# EAGLE design pc_kalam_sense_cap (EAGLE 6.4)
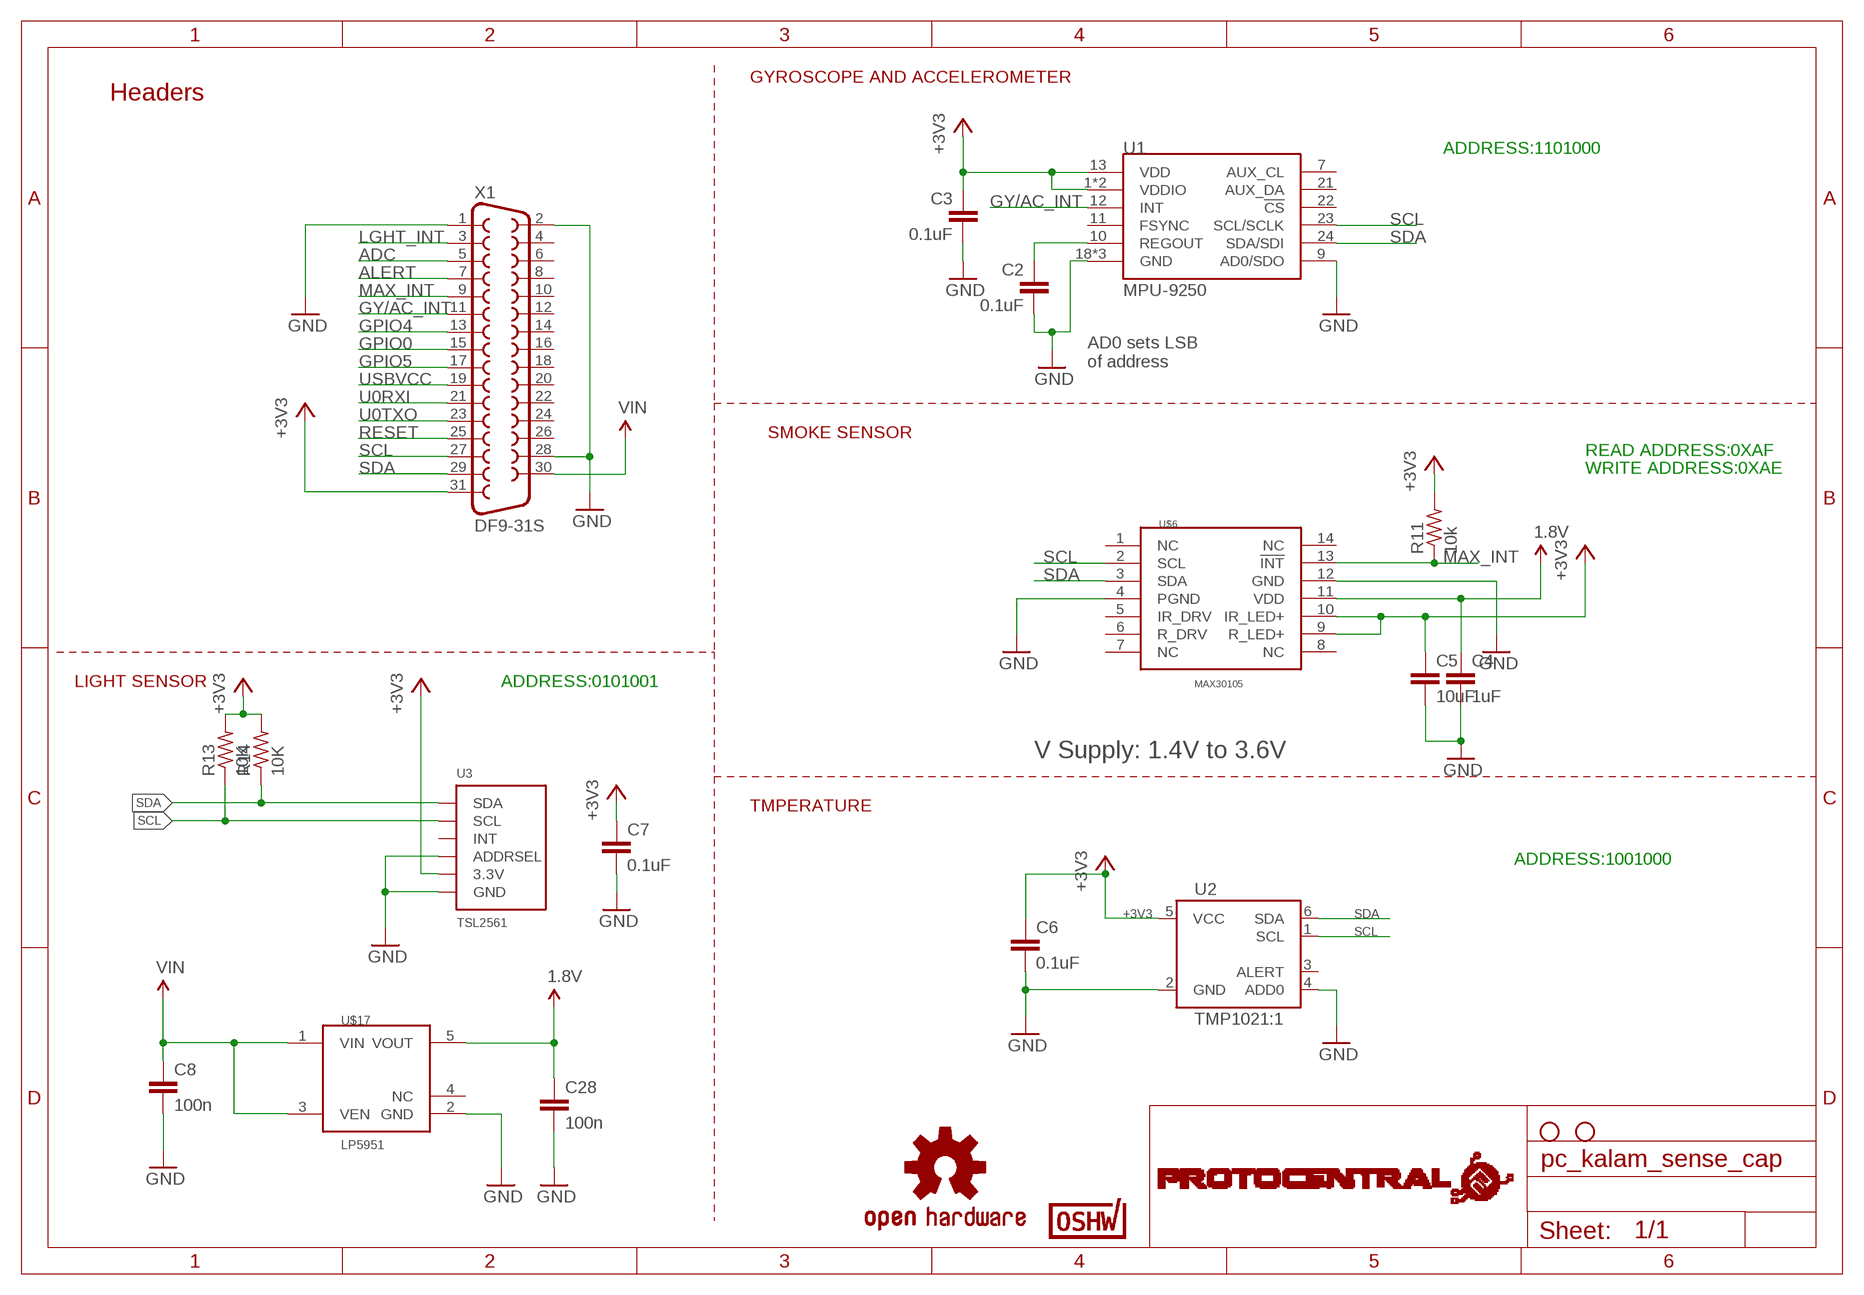
[diagram p0: schematic, sheet 1]

## Parts
C2  0.1uF  0.1UF-25V(+80/-20%)(0603)  [0603-CAP]
C3  0.1uF  0.1UF-25V(+80/-20%)(0603)  [0603-CAP]
C4  1uF  C-EUC0805  [C0805]
C5  10uF  C-EUC0805  [C0805]
C6  0.1uF  CAP0603-CAP  [0603-CAP]
C7  0.1uF  C-EUC0805  [C0805]
C8  100n  C-EUC0402  [C0402]
C28  100n  C-EUC0402  [C0402]
R11  10k  R-US_R0402  [R0402]
R13  10K  R-US_R0805  [R0805]
R14  10K  R-US_R0805  [R0805]
STANDOFF7  STAND-OFF  [STAND-OFF]
STANDOFF8  STAND-OFF  [STAND-OFF]
U1  MPU-9250  [QFN24_PAD]
U2  TMP1021:1  [SOT563-2]
U3  TSL2561  [TSL2561_FN]
U$2  CERT-SMALL  [CERT-SMALL-SILK]
U$3  OSHW-LOGOS  [OSHW-LOGO-S]
U$6  MAX30105  MAX30100  [OESIP-14]
U$9  PROTY_LOGO_WITH_TEXT  [PROTY_WITH_TEXT]
U$17  LP5951  [SC70-5]
X1  DF9-31S  [DF9-31S]

## Nets
1.8V: C4.1 C28.1 U$6.11(VDD) U$17.5(VOUT)
+3V3: C3.1 C5.1 C6.1 C7.1 R11.2 R13.2 R14.2 U1.1(VDDIO) U1.8(VDDIO) U1.13(VDD) U2.5(VCC) U3.VDD(3.3V) U$6.9(R_LED+) U$6.10(IR_LED+) X1.31
ADC: X1.5
ALERT: X1.7
GND: C2.2 C3.2 C4.2 C5.2 C6.2 C7.2 C8.2 C28.2 U1.9(AD0/SDO) U1.18(GND) U1.20(GND) U1.CENTER(GND) U2.2(GND) U2.4(ADD0) U3.ADR(ADDRSEL) U3.VSS(GND) U$6.4(PGND) U$6.12(GND) U$17.2(GND) X1.1 X1.2 X1.28
GPIO0: X1.15
GPIO4: X1.13
GPIO5: X1.17
GY/AC_INT: U1.12(INT) X1.11
LGHT_INT: X1.3
MAX_INT: R11.1 U$6.13(!INT) X1.9
REGOUT: C2.1 U1.10(REGOUT)
RESET: X1.25
SCL: R13.1 U1.23(SCL/SCLK) U2.1(SCL) U3.CLK(SCL) U$6.2(SCL) X1.27
SDA: R14.1 U1.24(SDA/SDI) U2.6(SDA) U3.DATA(SDA) U$6.3(SDA) X1.29
U0RXI: X1.21
U0TXO: X1.23
USBVCC: X1.19
VIN: C8.1 U$17.1(VIN) U$17.3(VEN) X1.30
Unconnected: U1.7(AUX_CL) U1.11(FSYNC) U1.21(AUX_DA) U1.22(!CS) U2.3(ALERT) U3.INT U$6.1(NC) U$6.5(IR_DRV) U$6.6(R_DRV) U$6.7(NC) U$6.8(NC) U$6.14(NC) U$17.4(NC) X1.4 X1.6 X1.8 X1.10 X1.12 X1.14 X1.16 X1.18 X1.20 X1.22 X1.24 X1.26

## Notes on the sheet
- GYROSCOPE AND ACCELEROMETER
- Headers
- ADDRESS:1101000
- AD0 sets LSB
  of address
- SMOKE SENSOR
- READ ADDRESS:0XAF
- WRITE ADDRESS:0XAE
- LIGHT SENSOR | ADDRESS:0101001
- V Supply: 1.4V to 3.6V
- TMPERATURE
- ADDRESS:1001000

## Library data of the parts
C2 C3 = SparkFun-Capacitors:0.1UF-25V(+80/-20%)(0603): CAP-00810 Ceramic Standard decoupling cap; PROD_ID: CAP-00810
C4 C5 C7 C8 C28 = rcl:C-EU: CAPACITOR, European symbol
C6 = SparkFun:CAP: Capacitor Standard 0603 ceramic capacitor, and 0.1" leaded capacitor.
R11 R13 R14 = rcl:R-US_: RESISTOR, American symbol
STANDOFF7 STANDOFF8 = SparkFun-Electromechanical:STAND-OFF: #4 Stand Off This is the mechanical footprint for a #4 phillips button head screw. Use the keepout ring to avoid running the screw head into surrounding components. SKU : PRT-00447
U1 = Testing:MPU-9250: NC pin 19. 2-6 & 14-17 not internally connected. May be used for PCB trace routing.; PROD_ID: IC-13192
U2 = SparkFun-Sensors:TMP102: I2C degC temp sensor
U3 = microbuilder:TSL2561: TSL2561 Light-To-Digital Sensor Mouser Part Numbers: CS (obsolete): 856-TSL2561CS DFN (cheapest): 856-TSL2561FN
U$2 = OSHWA:CERT
U$3 = SparkFun:OSHW-LOGO: Open Source Hardware Logo This logo indicates the piece of hardware it is found on incorporates a OSHW license and/or adheres to the definition of open source hardware found here: http://freedomdefined.org/OSHW
U$6 = circuitects:MAX30100
U$9 = circuitects:PROTY_LOGO_WITH_TEXT
U$17 = circuitects:LP5951
X1 = con-hirose:DF9-31S: SMD CONNECTOR Source: con-hirose.lbr from Bob Starr <rtzaudio@mindspring.com>; MPN: DF9-31S-1V(32); OC_FARNELL: 1798382; OC_NEWARK: 74R3383

## Board
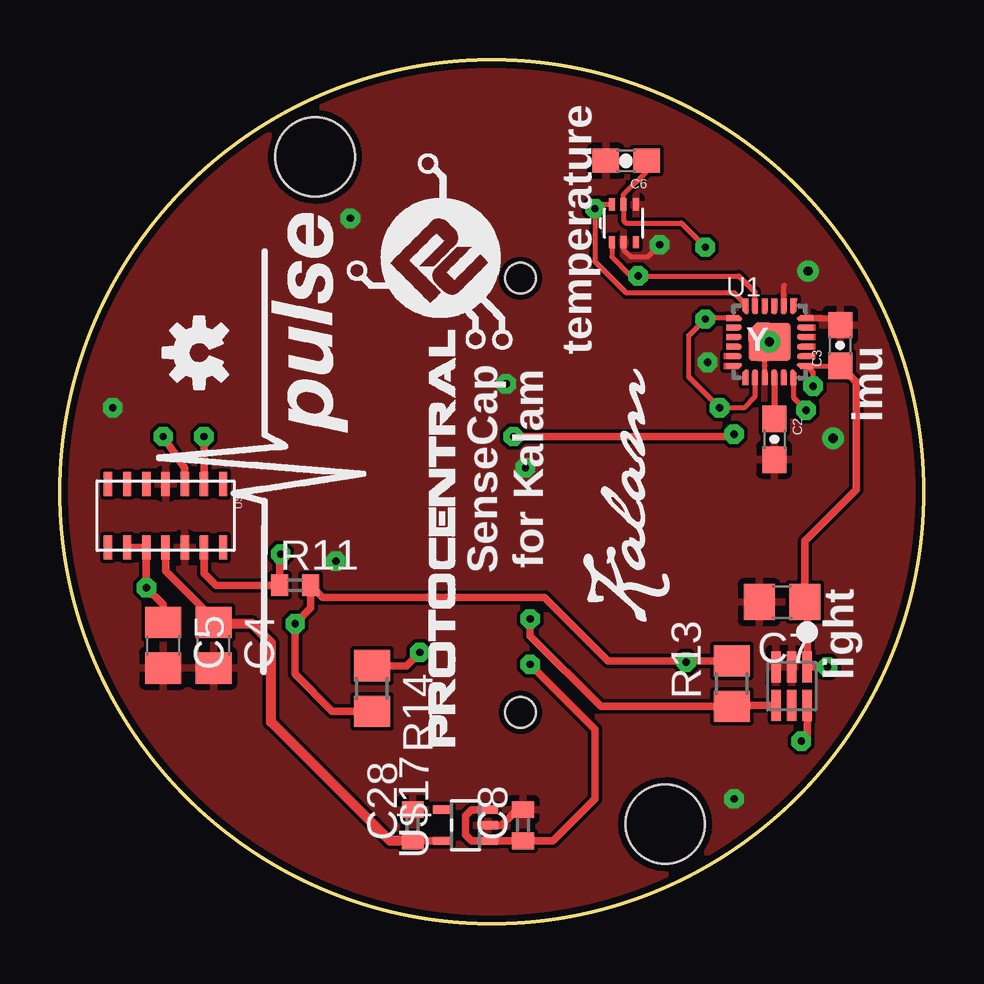
[diagram p1: board, top side]
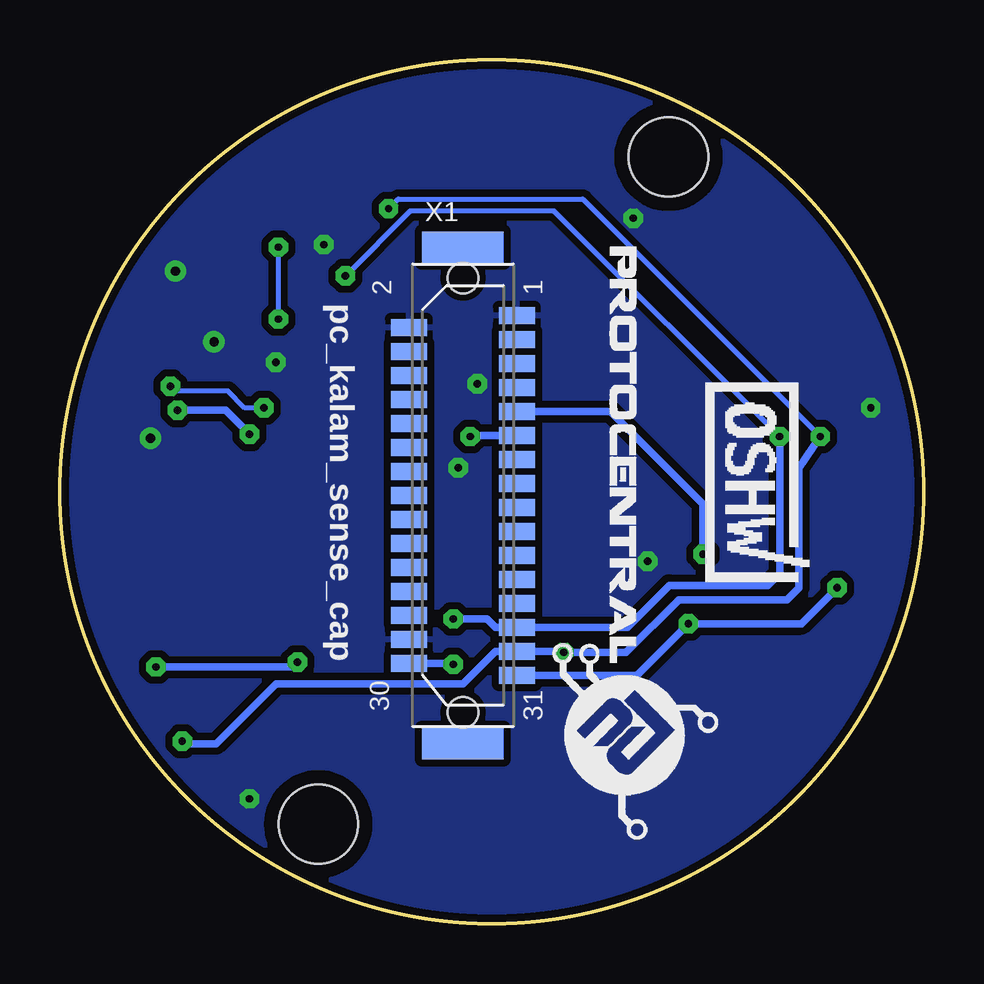
[diagram p2: board, bottom side, seen from below]

Size 36 x 36 mm. Coordinates in mm from the lower left corner, seen from the top.
Outline: circle at 18,18 radius 18
Copper layers (1*2*15*16): Top 0.035mm / dielectric 1.5mm / Route2 0.035mm / dielectric 0.15mm / Route15 0.035mm / dielectric 0.2mm / Bottom 0.035mm
Design rules "Circuitects-Rules": minimum track width 6mil, minimum drill 0.3mm, track to track 6mil, track to pad 6mil, pad to pad 6mil, via to via 6mil, smd to smd 6mil, copper to edge 10mil, drill to drill 8mil, minimum pad ring 12mil, minimum via ring 10mil, stop-mask expansion 4mil, vias tented up to drill 25mil, thermal gap 10mil

### Footprints (pad centres in the part's own frame; a part is rotated, then mirrored left to right if it is on the bottom)
0603-CAP = smd 1.1 x 1: 1 -0.85,0; 2 0.85,0
C0805 = smd 1.3 x 1.5: 1 -0.95,0; 2 0.95,0
C0402 = smd 0.7 x 0.9: 1 -0.65,0; 2 0.65,0
R0402 = smd 0.7 x 0.9: 1 -0.65,0; 2 0.65,0
R0805 = smd 1.3 x 1.5: 1 -0.95,0; 2 0.95,0
STAND-OFF = hole 3.302: 0,0
QFN24_PAD = smd 0.5 x 0.25: 1 -1.55,1; 2 -1.55,0.6; 3 -1.55,0.2; 4 -1.55,-0.2; 5 -1.55,-0.6; 6 -1.55,-1; 13 1.55,-1; 14 1.55,-0.6; 15 1.55,-0.2; 16 1.55,0.2; 17 1.55,0.6; 18 1.55,1 | smd 0.08 x 0.13: 1$1 -1.32,1.06; 1$3 -1.26,0.94; P$33 1.26,-0.94; P$34 1.32,-1.06; P$58 1.26,0.94; P$59 1.32,1.06; P$68 -1.26,-0.94; P$69 -1.32,-1.06 | smd 0.1 x 0.185 rotated 45: 1$2 -1.25,1.024; P$49 1.024,-1.25 | smd 0.14 x 0.14: 1$4 -1.22,0.945; P$23 -0.945,-1.22; P$24 1.22,-0.945; P$36 0.945,1.22; P$51 0.945,-1.22; P$56 1.22,0.945; P$61 -0.945,1.22; P$66 -1.22,-0.945 | smd 0.05 x 0.05: 1$5 -1.175,0.97; P$25 -0.97,-1.175; P$31 1.175,-0.97; P$37 0.97,1.175; P$52 0.97,-1.175; P$57 1.175,0.97; P$62 -0.97,1.175; P$67 -1.175,-0.97 | smd 0.25 x 0.5: 7 -1,-1.55; 8 -0.6,-1.55; 9 -0.2,-1.55; 10 0.2,-1.55; 11 0.6,-1.55; 12 1,-1.55; 19 1,1.55; 20 0.6,1.55; 21 0.2,1.55; 22 -0.2,1.55; 23 -0.6,1.55; 24 -1,1.55 | smd 0.25 x 0.25: CENTER 0,0 | smd 0.4 x 0.4: DBBADFE -0.675,0.24 | smd 0.6 x 1.2: DBBADFE1 -0.575,-0.195 | smd 0.25 x 0.3: P$1 -0.2,1.3; P$3 0.2,1.3; P$5 0.6,1.3; P$11 -0.6,1.3; P$16 0.2,-1.3; P$18 -0.2,-1.3; P$20 -0.6,-1.3; P$26 0.6,-1.3 | smd 0.3 x 0.25: P$2 -1.3,0.2; P$4 -1.3,0.6; P$28 -1.3,-0.2; P$38 -1.3,-0.6; P$40 1.3,0.2; P$42 1.3,-0.2; P$44 1.3,-0.6; P$50 1.3,0.6 | smd 0.1 x 0.185 rotated 225: P$7 1.25,-1.024; P$60 -1.024,1.25 | smd 1.1 x 1.59: P$13 0.325,0 | smd 0.3 x 0.5 rotated 315: P$14 -0.592,0.512 | smd 0.5 x 1.59: P$15 -0.27,0 | smd 0.1 x 0.185 rotated 135: P$22 -1.024,-1.25; P$55 1.25,1.024 | smd 0.13 x 0.08: P$27 -0.94,-1.26; P$29 -1.06,-1.32; P$39 0.94,1.26; P$41 1.06,1.32; P$53 0.94,-1.26; P$54 1.06,-1.32; P$63 -0.94,1.26; P$64 -1.06,1.32 | smd 0.1 x 0.185 rotated 315: P$35 1.024,1.25; P$65 -1.25,-1.024
SOT563-2 = smd 0.508 x 0.249: 1 -0.8,0.498; 2 -0.8,0.003; 3 -0.8,-0.506; 4 0.776,-0.506; 5 0.776,0.003; 6 0.776,0.498
TSL2561_FN = smd 1.3 x 0.4: ADR -0.8,0; CLK 0.8,-0.65; DATA 0.8,0.65; INT 0.8,0; VDD -0.8,0.65; VSS -0.8,-0.65
OESIP-14 = smd 1 x 0.35: 1 -1.325,2.4; 2 -1.325,1.6; 3 -1.325,0.8; 4 -1.325,0; 5 -1.325,-0.8; 6 -1.325,-1.6; 7 -1.325,-2.4; 8 1.325,-2.4; 9 1.325,-1.6; 10 1.325,-0.8; 11 1.325,0; 12 1.325,0.8; 13 1.325,1.6; 14 1.325,2.4
SC70-5 = smd 0.35 x 0.8: 1 -0.65,-0.95; 2 0,-0.95; 3 0.65,-0.95; 4 0.65,0.95; 5 -0.65,0.95
DF9-31S = smd 0.7 x 1.5: 1 -7.5,2.25; 2 -7,-2.25; 3 -6.5,2.25; 4 -6,-2.25; 5 -5.5,2.25; 6 -5,-2.25; 7 -4.5,2.25; 8 -4,-2.25; 9 -3.5,2.25; 10 -3,-2.25; 11 -2.5,2.25; 12 -2,-2.25; 13 -1.5,2.25; 14 -1,-2.25; 15 -0.5,2.25; 16 0,-2.25; 17 0.5,2.25; 18 1,-2.25; 19 1.5,2.25; 20 2,-2.25; 21 2.5,2.25; 22 3,-2.25; 23 3.5,2.25; 24 4,-2.25; 25 4.5,2.25; 26 5,-2.25; 27 5.5,2.25; 28 6,-2.25; 29 6.5,2.25; 30 7,-2.25; 31 7.5,2.25 | smd 1.3 x 3.4: M1 -10.35,0; M2 10.35,0 | hole 1.27: 9.05,0; -9.05,0

### Placement (x,y rotation side)
C2  29.78,20.19 270 top
C3  32.52,24.1 90 top
C4  6.4,11.6 270 top
C5  4.3,11.6 270 top
C6  23.6,31.8 180 top
C7  30.1,13.4 180 top
C8  19.3,4.1 90 top
C28  14.7,4.1 90 top
R11  9.8,14.1 0 top
R13  28,10 90 top
R14  13,9.8 270 top
STANDOFF7  10.64,31.96 0 bottom
STANDOFF8  25.24,4.14 0 bottom
U1  29.58,24.25 0 top
U2  23.5,29.2 90 top
U3  30.5,9.9 270 top
U$1  [PULSE]  13.3,10 90 top
U$2  9.1,18.4 270 bottom
U$3  5.8,23.8 90 top
U$4  [KALAM-NAME-ONLY]  25.4,12.5 90 top
U$5  PROTY_LOGO_WITH_TEXT  [PROTY_WITH_TEXT]  18.5,7.4 90 top
U$6  4.4,17 270 top
U$9  15.1,28.2 270 bottom
U$17  16.9,4.1 90 top
X1  19.2,17.85 270 bottom

### Tracks (layer width: path | path; a pad name or v marks a point on that pad's centre or on a via)
1.8V
  Top 0.305: U$6.11 4.4,14.7 6.4,12.7 C4.1 | U$17.5 C28.1
  Top 0.406: C28.1 13.75,3.45 8.8,8.4 8.8,11.7 8,12.5 6.45,12.5 C4.1
+3V3  (via drill 0.3)
  Top 0.2: C6.1 24.45,31.35 23.5,30.4 U2.5 23.5,29.3 23.6,29.2 25.9,29.2 v26.9,28.2 | U1.8 28.98,21.98 28.5,21.5 v27.5,21.5 26.2,22.8 26.2,24.5 v26.9,25.2 26.95,25.25 U1.1 | C3.1 U1.13 31.4,22.98 v31.4,22.4
  Top 0.254: C3.1
  Top 0.305: U$6.9 U$6.10 v3.6,14 4.3,13.3 C5.1 | R14.2 11.35,8.85 9.8,10.4 v9.8,12.5 10.45,13.15 R11.2 10.95,13.6 20.2,13.6 22.85,10.95 26.05,10.95 v26.1,10.9 26.15,10.95 R13.2 | v32,10.7 U3.VDD 31.15,13.3 C7.1 31.05,15.95 33.2,18.1 33.2,22.57 C3.1
  Bottom 0.2: v27.5,21.5 28.3,21.5 29,22.2 31.2,22.2 v31.4,22.4 | v26.9,28.2 v26.9,25.2
  Bottom 0.305: v3.6,14 5.1,12.5 v9.8,12.5 11.95,10.35 X1.31 | v32,10.7 26.3,10.7 v26.1,10.9
GND  (via drill 0.3, 0.38)
  Top 0.2: U1.9 29.38,24.05 U1.CENTER | U1.20 30.18,26.58 30.2,26.6 | U2.2 23.5,28.1 23.8,27.8 24.5,27.8 v25,28.3
  Top 0.254: U1.18 32.52,25.25 C3.2
  Top 0.305: U$17.2 18.4,4.1 19.05,4.75 C8.2
  other vias: 12.1,29.4 28.1,5.2 2.2,21.5 11.5,15.1 29.58,24.25 32.23,20.23 31.19,27.2 18.6,22.5 19.4,19 27,23.4
  pour Bottom (isolate 0.305, rank 6): -1.5,-1.35 -1.3,31.65 -1.1,38.4 -1.1,38.7 32.3,38.8 36.9,39.05 36.93,3.45 36.9,-1.45 32.3,-1.6
  pour Top: -1.3,38.1 36.5,38.1 36.5,-1.6 -1.3,-1.6
GY/AC_INT  (via drill 0.3)
  Top 0.2: U1.12 30.58,21.92 v31.1,21.4
  Top 0.305: v18.9,20.3 28,20.3 v28.1,20.4
  Bottom 0.305: X1.11 18.85,20.35 v18.9,20.3 | v31.1,21.4 29.1,21.4 v28.1,20.4
MAX_INT  (via drill 0.3)
  Top 0.305: U$6.13 6,14.6 6.5,14.1 R11.1 9.15,15.35 v9.2,15.4
  Bottom 0.305: v9.2,15.4 9.2,17.5 11.95,20.25 12.3,20.6 13.05,21.35 X1.9
REGOUT
  Top 0.254: U1.10 C2.1
SCL  (via drill 0.3)
  Top 0.2: 23,28.3 U2.1 23,27.8 23.8,27 v24.1,27 28.3,27 28.98,26.32 U1.23
  Top 0.305: U$6.2 v6,20.3 | v19.6,12.7 19.6,12 22.55,9.05 R13.1 28.05,9.1 U3.CLK
  Bottom 0.2: v6,20.3 15.4,29.7 21.4,29.7 v24.1,27
  Bottom 0.305: v6,20.3 6,14.6 6.5,14.1 10.6,14.1 12.35,12.35 X1.27 17.85,12.35 18.2,12.7 v19.6,12.7
SDA  (via drill 0.3)
  Top 0.2: U2.6 22.48,29.98 v22.3,29.8 22.3,27.6 23.6,26.3 28.1,26.3 28.58,25.82 U1.24
  Top 0.305: U$6.3 5.2,19 v4.3,20.3 | R14.1 14.45,10.75 v15,11.3 | U3.DATA 31.15,7.85 v30.9,7.6
  Bottom 0.2: v22.3,29.8 21.9,30.2 14.2,30.2 v4.3,20.3
  Bottom 0.305: v4.3,20.3 5.2,19 5.2,14 5.7,13.5 10.2,13.5 12.4,11.3 v15,11.3 15.05,11.35 X1.29 17.85,11.35 19.2,10 27,10 29.5,7.5 30.8,7.5 v30.9,7.6
VIN  (via drill 0.3)
  Top 0.305: U$17.3 17.15,4.75 16.9,4.5 16.9,3.7 17.15,3.45 U$17.1 C8.1 20.55,3.45 22.3,5.2 22.3,8.1 v19.6,10.8
  Bottom 0.305: X1.30 19.65,10.85 v19.6,10.8
(copper drawn outside any net)
  shapes: Top area x7

### Text on the board
tPlace: temperature | Y | imu | SenseCap / for Kalam | light
bPlace: pc_kalam_sense_cap